# EAGLE design led quadcoopter (EAGLE 7.3.0)
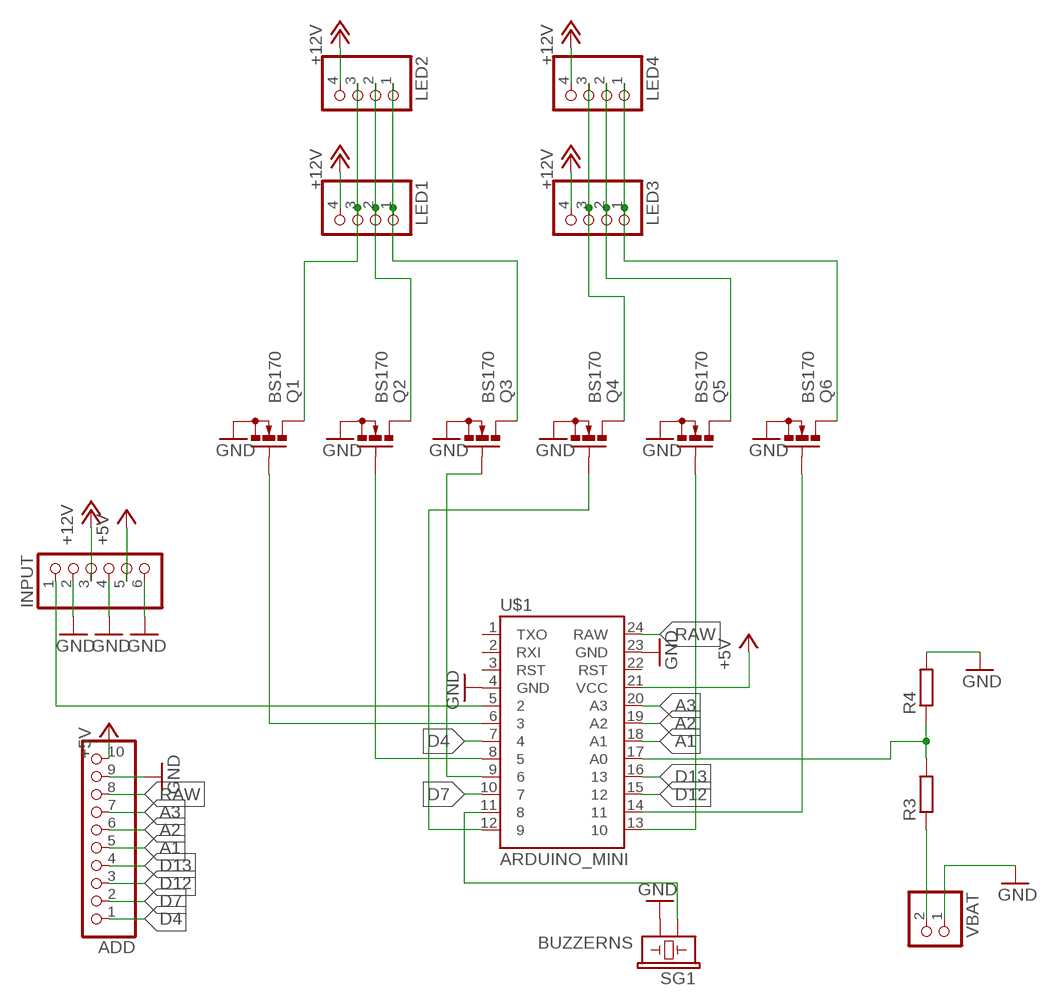
[diagram p0: schematic, sheet 1]

## Parts
ADD  PINHD-1X10  [1X10]
INPUT  PINHD-1X6  [1X06]
LED1  PINHD-1X4  [1X04]
LED2  PINHD-1X4  [1X04]
LED3  PINHD-1X4  [1X04]
LED4  PINHD-1X4  [1X04]
Q1  BS170  [SOT54E]
Q2  BS170  [SOT54E]
Q3  BS170  [SOT54E]
Q4  BS170  [SOT54E]
Q5  BS170  [SOT54E]
Q6  BS170  [SOT54E]
R3  R-EU_0207/10  [0207/10]
R4  R-EU_0207/10  [0207/10]
SG1  BUZZERNS  [BUZZER-12MM-NS]
U$1  ARDUINO_MINI  [ARDUINO_MINI]
VBAT  PINHD-1X2  [1X02]

## Nets
+5V [POWER]: ADD.10 INPUT.5 U$1.21(VCC)
+12V [12V]: INPUT.3 LED1.4 LED2.4 LED3.4 LED4.4
A1: ADD.5 U$1.18(A1)
A2: ADD.6 U$1.19(A2)
A3: ADD.7 U$1.20(A3)
D4: ADD.1 U$1.7
D7: ADD.2 U$1.10
D12: ADD.3 U$1.15
D13: ADD.4 U$1.16
GND [POWER]: ADD.9 INPUT.2 INPUT.4 INPUT.6 Q1.S Q2.S Q3.S Q4.S Q5.S Q6.S R4.2 SG1.- U$1.4(GND) U$1.23(GND) VBAT.1
N$1 [LED alim]: LED1.3 LED2.3 Q1.D
N$2 [LED alim]: LED1.2 LED2.2 Q2.D
N$3: SG1.+ U$1.11
N$4: INPUT.1 U$1.5
N$8 [LED alim]: LED1.1 LED2.1 Q3.D
N$9 [LED alim]: LED3.3 LED4.3 Q4.D
N$10 [LED alim]: LED3.2 LED4.2 Q5.D
N$11 [LED alim]: LED3.1 LED4.1 Q6.D
N$16: Q1.G U$1.6
N$17: Q2.G U$1.8
N$18: Q3.G U$1.9
N$19: Q4.G U$1.12
N$20: Q5.G U$1.13
N$21: Q6.G U$1.14
N$23: R3.1 VBAT.2
N$24: R3.2 R4.1 U$1.17(A0)
RAW: ADD.8 U$1.24(RAW)
Unconnected: U$1.1(TXO) U$1.2(RXI) U$1.3(RST) U$1.22(RST)

## Library data of the parts
ADD = pinhead:PINHD-1X10: PIN HEADER
INPUT = pinhead:PINHD-1X6: PIN HEADER
LED1-LED4 = pinhead:PINHD-1X4: PIN HEADER
Q1-Q6 = transistor-small-signal:BS170: N-CHANNEL MOS FET
R3 R4 = rcl:R-EU_: RESISTOR, European symbol
SG1 = SparkFun-Electromechanical:BUZZER: Buzzer 12mm Spark Fun Electronics SKU : Comp-Buzzer
U$1 = SparkFun-Boards:ARDUINO_MINI: Arduino Pro Mini footprint
VBAT = pinhead:PINHD-1X2: PIN HEADER

## Net classes
1 POWER: width 0.406 mm, clearance 0.305 mm
2 LED alim: width 0.508 mm, clearance 0.381 mm
3 12V: width 0.635 mm, clearance 0.381 mm

## Board
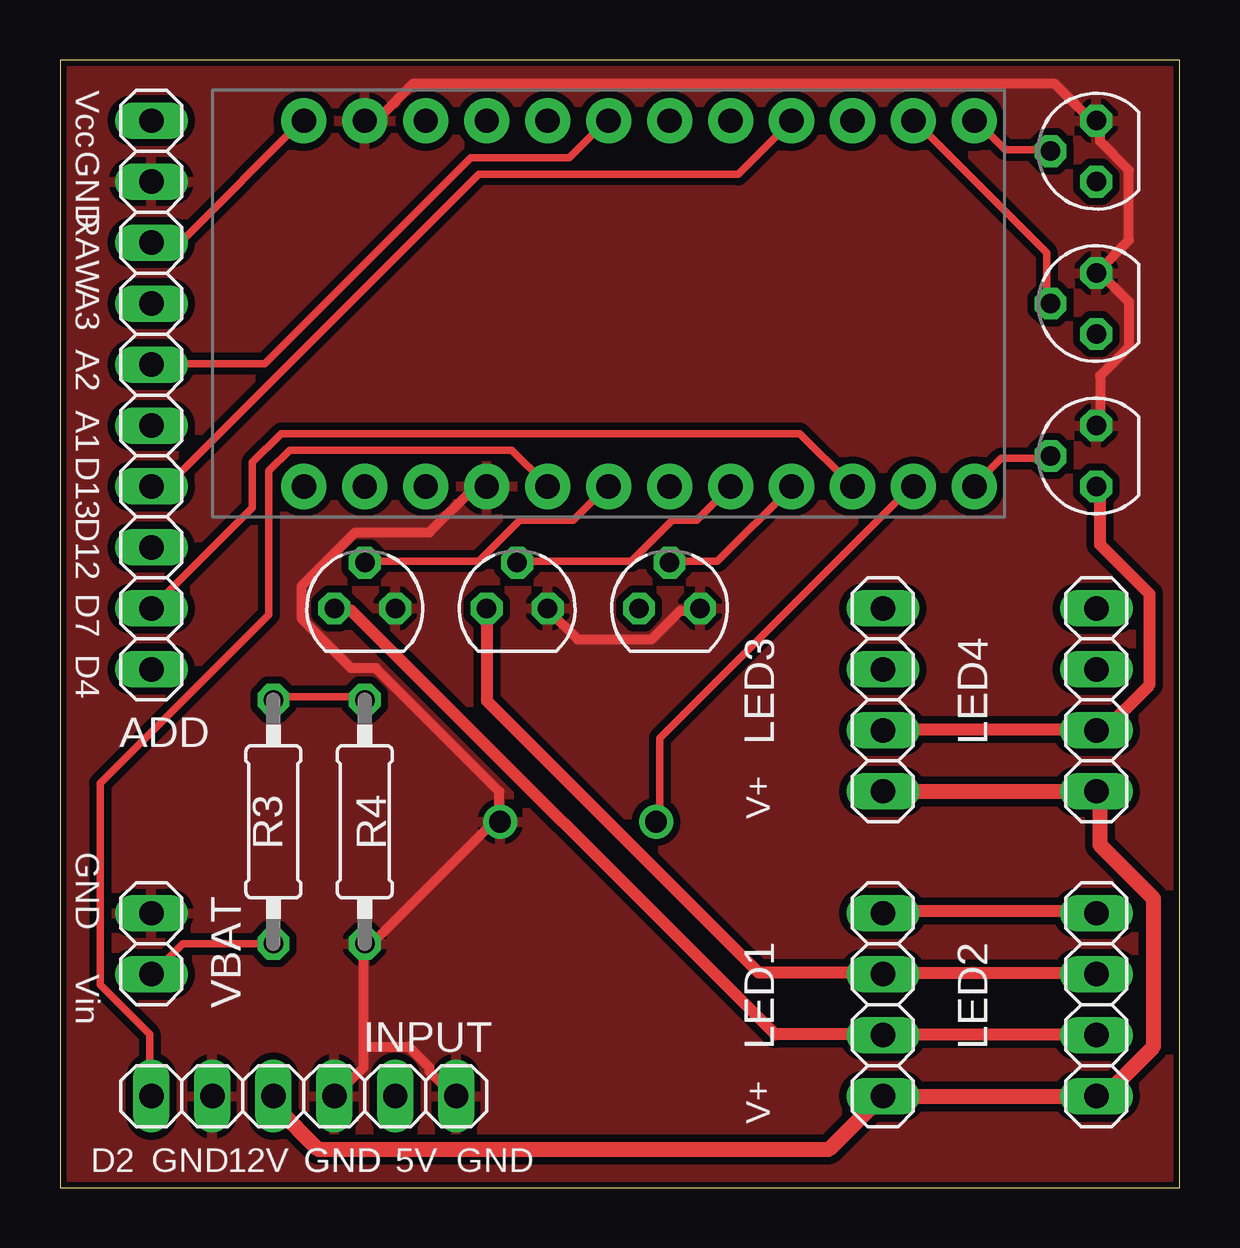
[diagram p1: board, top side]
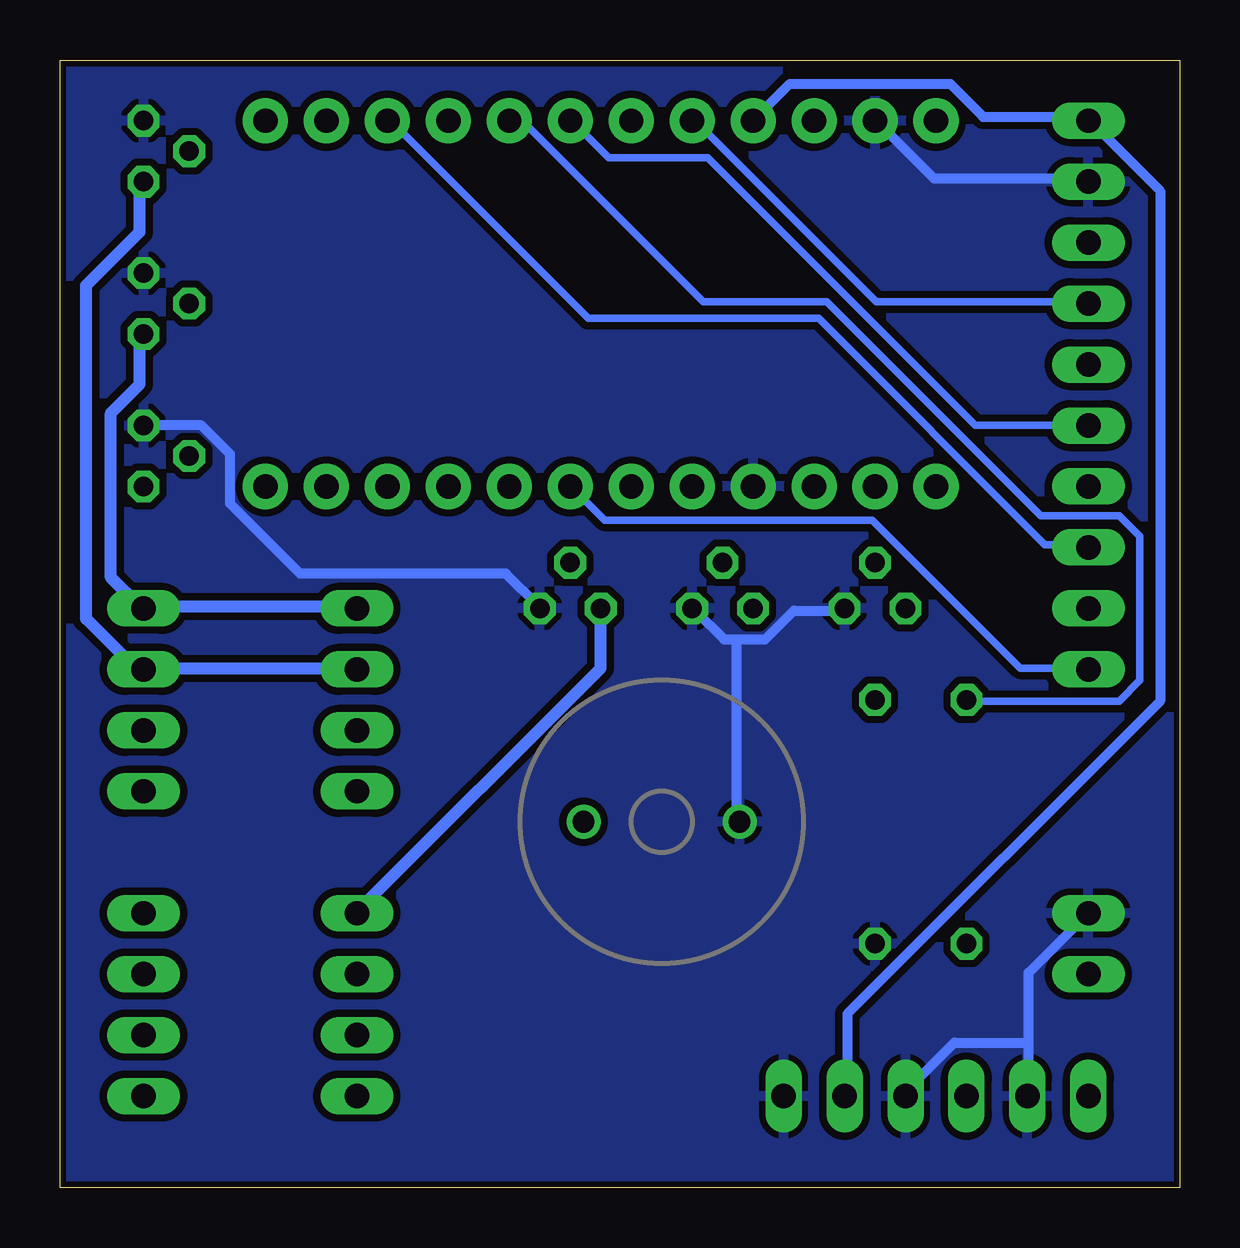
[diagram p2: board, bottom side, seen from below]

Size 46.66 x 46.98 mm. Coordinates in mm from the lower left corner, seen from the top.
Outline: 0,0 46.66,0 46.66,46.98 0,46.98 0,0
Copper layers (1*16): Top 0.035mm / dielectric 1.5mm / Bottom 0.035mm
Design rules "SeeedStudio_2layer_DRU_no_angle_20140221": minimum track width 6mil, minimum drill 12mil, track to track 6mil, track to pad 6mil, pad to pad 6mil, via to via 6mil, smd to smd 0mil, copper to edge 10mil, drill to drill 10mil, minimum pad ring 10mil, minimum via ring 6mil, stop-mask expansion 2mil, vias tented up to drill 100mil, thermal gap 10mil

### Footprints (pad centres in the part's own frame; a part is rotated, then mirrored left to right if it is on the bottom)
1X10 = drill 1.016 long: 1 -11.43,0; 2 -8.89,0; 3 -6.35,0; 4 -3.81,0; 5 -1.27,0; 6 1.27,0; 7 3.81,0; 8 6.35,0; 9 8.89,0; 10 11.43,0
1X06 = drill 1.016 long: 1 -6.35,0; 2 -3.81,0; 3 -1.27,0; 4 1.27,0; 5 3.81,0; 6 6.35,0
1X04 = drill 1.016 long: 1 -3.81,0; 2 -1.27,0; 3 1.27,0; 4 3.81,0
SOT54E = drill 0.813 octagon: D -1.27,0; G 0,1.905; S 1.27,0
0207/10 = drill 0.813 octagon: 1 -5.08,0; 2 5.08,0
BUZZER-12MM-NS = drill 0.9: + 3.25,0; - -3.25,0
ARDUINO_MINI = drill 1.016 pad 1.88: 1 -7.62,12.7; 2 -7.62,10.16; 3 -7.62,7.62; 4 -7.62,5.08; 5 -7.62,2.54; 6 -7.62,0; 7 -7.62,-2.54; 8 -7.62,-5.08; 9 -7.62,-7.62; 10 -7.62,-10.16; 11 -7.62,-12.7; 12 -7.62,-15.24; 13 7.62,-15.24; 14 7.62,-12.7; 15 7.62,-10.16; 16 7.62,-7.62; 17 7.62,-5.08; 18 7.62,-2.54; 19 7.62,0; 20 7.62,2.54; 21 7.62,5.08; 22 7.62,7.62; 23 7.62,10.16; 24 7.62,12.7
1X02 = drill 1.016 long: 1 -1.27,0; 2 1.27,0

### Placement (x,y rotation side)
ADD  3.81,33.02 90 top
INPUT  10.16,3.81 0 top
LED1  34.29,7.62 270 top
LED2  43.18,7.62 270 top
LED3  34.29,20.32 270 top
LED4  43.18,20.32 270 top
Q1  12.7,24.13 0 top
Q2  19.05,24.13 0 top
Q3  25.4,24.13 0 top
Q4  43.18,30.48 90 top
Q5  43.18,43.18 90 top
Q6  43.18,36.83 90 top
R3  8.89,15.24 90 top
R4  12.7,15.24 270 top
SG1  21.59,15.24 180 bottom
U$1  22.86,36.83 90 top
VBAT  3.81,10.16 270 top

### Tracks (layer width: path | path; a pad name or v marks a point on that pad's centre or on a via)
+5V
  Bottom 0.406: U$1.21 17.62,44.61 16.25,45.99 9.56,45.99 8.19,44.61 3.9,44.61 ADD.10 3.73,44.44 0.82,41.53 0.82,20.27 13.85,7.24 13.85,3.81 INPUT.5
+12V
  Top 0.635: LED3.4 34.42,16.5 43.17,16.5 LED4.4 43.34,16.33 43.34,14.27 45.57,12.04 45.57,5.87 43.34,3.64 LED2.4 LED1.4 34.25,3.81 32.02,1.58 10.76,1.58 9.05,3.3 9.05,3.81 INPUT.3
A1
  Bottom 0.305: ADD.5 3.9,31.76 8.53,31.76 19.68,42.9 23.79,42.9 25.34,44.44 U$1.18
A2
  Top 0.305: ADD.6 3.9,34.33 8.53,34.33 17.11,42.9 21.22,42.9 22.77,44.44 U$1.19
A3
  Bottom 0.305: ADD.7 3.9,36.9 12.65,36.9 20.19,44.44 U$1.20
D4
  Bottom 0.305: ADD.1 3.9,21.64 6.65,21.64 12.82,27.81 23.96,27.81 25.34,29.18 U$1.7
D7
  Top 0.305: ADD.2 3.9,24.21 8.02,28.33 8.02,30.21 9.22,31.41 30.82,31.41 32.88,29.36 U$1.10
D12
  Bottom 0.305: ADD.3 3.9,26.78 5.62,26.78 15.05,36.21 24.65,36.21 32.88,44.44 U$1.15
D13
  Top 0.305: ADD.4 3.9,29.36 4.59,29.36 17.45,42.21 28.25,42.21 U$1.16
GND
  Top 0.406: 12.65,5.87 12.65,5.01 11.45,3.81 INPUT.4 | 12.65,5.87 12.65,10.15 R4.2 12.82,10.32 13.16,10.32 18.14,15.3 SG1.- 18.31,15.3 18.31,16.5 13.16,21.64 12.13,21.64 10.08,23.7 10.08,25.07 12.31,27.3 15.39,27.3 17.28,29.18 17.62,29.18 U$1.4 | 12.65,5.87 14.53,5.87 15.39,5.01 15.39,4.84 16.42,3.81 INPUT.6 | Q4.S 43.34,31.76 43.34,33.81 44.54,35.01 44.54,36.9 43.34,38.1 Q6.S 43.34,38.27 44.54,39.47 44.54,42.39 43.34,43.59 43.34,44.44 Q5.S 43,44.44 41.45,45.99 14.71,45.99 13.33,44.61 12.82,44.61 U$1.23 | Q3.S 26.54,24.04 25.85,24.04 24.65,22.84 21.57,22.84 20.36,24.04 Q2.S
  Bottom 0.406: 6.31,6.04 6.31,3.81 INPUT.2 | 6.31,6.04 6.31,8.95 3.9,11.35 VBAT.1 | 6.31,6.04 9.39,6.04 11.28,4.15 11.28,3.81 INPUT.4 | ADD.9 3.9,42.04 10.25,42.04 12.65,44.44 U$1.23 | 18.48,22.84 18.99,22.84 20.19,24.04 Q2.S | 18.48,22.84 17.28,22.84 16.08,24.04 14.02,24.04 Q1.S | 18.48,22.84 18.48,15.3 SG1.- | Q4.S 43.17,31.76 40.77,31.76 39.57,30.56 39.57,28.5 36.65,25.58 28.08,25.58 26.71,24.21 Q3.S
  pour Bottom: 0,0 0,46.99 46.99,46.99 46.99,0
  pour Top: 0,46.99 46.99,46.99 46.99,0 0,0
N$1
  Top 0.508: Q1.D 11.45,24.04 12.13,24.04 29.79,6.38 34.25,6.38 LED1.3 34.42,6.38 43.17,6.38 LED2.3
N$2
  Top 0.508: Q2.D 17.79,24.04 17.79,20.27 29.11,8.95 34.25,8.95 LED1.2 34.42,8.95 43.17,8.95 LED2.2
N$3
  Top 0.305: SG1.+ 24.99,15.3 24.99,18.73 35.45,29.18 U$1.11
N$4
  Top 0.305: INPUT.1 3.73,3.81 3.73,6.38 1.68,8.44 1.68,16.84 8.71,23.87 8.71,29.87 9.56,30.73 18.82,30.73 20.19,29.36 U$1.5
N$8
  Top 0.508: LED2.1 43.17,11.53 34.42,11.53 LED1.1
  Bottom 0.508: Q3.D 24.14,24.04 24.14,21.64 34.25,11.53 LED1.1
N$9
  Top 0.508: Q4.D 43.34,29.18 43.34,26.78 45.4,24.73 45.4,20.96 43.34,18.9 LED4.3 43,19.07 34.42,19.07 LED3.3
N$10
  Bottom 0.508: Q5.D 43.34,41.87 43.34,39.81 45.57,37.59 45.57,23.7 43.34,21.47 LED4.2 43,21.64 34.42,21.64 LED3.2
N$11
  Bottom 0.508: Q6.D 43.34,35.53 43.34,33.47 44.54,32.27 44.54,25.41 43.34,24.21 LED4.1 43,24.21 34.42,24.21 LED3.1
N$16
  Top 0.305: Q1.G 12.82,26.1 17.45,26.1 19.16,27.81 21.39,27.81 22.77,29.18 U$1.6
N$17
  Top 0.305: Q2.G 19.16,26.1 23.79,26.1 25.51,27.81 26.54,27.81 27.91,29.18 U$1.8
N$18
  Top 0.305: Q3.G 25.51,26.1 27.39,26.1 30.48,29.18 U$1.9
N$19
  Top 0.305: Q4.G 41.11,30.39 39.22,30.39 38.2,29.36 U$1.12
N$20
  Top 0.305: Q5.G 41.11,43.24 39.39,43.24 38.2,44.44 U$1.13
N$21
  Top 0.305: Q6.G 41.11,36.9 41.11,38.96 35.62,44.44 U$1.14
N$23
  Top 0.305: R3.1 8.88,10.15 5.1,10.15 3.9,8.95 VBAT.2
N$24
  Top 0.305: R3.2 9.05,20.44 12.65,20.44 R4.1
  Bottom 0.305: U$1.17 27.91,44.44 27.39,44.44 19.85,36.9 14.71,36.9 5.79,27.98 2.53,27.98 1.68,27.13 1.68,21.13 2.53,20.27 8.88,20.27 R3.2
RAW
  Top 0.305: ADD.8 3.9,39.47 5.1,39.47 10.08,44.44 U$1.24

### Text on the board
tNames: Vcc | GND | RAW | A3 | A2 | A1 | D13 | D12 | D7 | D4 | V+ | GND | Vin | V+ | D2 | GND | 12V | GND | GND | 5V | GND